# EAGLE design LED-Board_long (EAGLE 9.2.2)
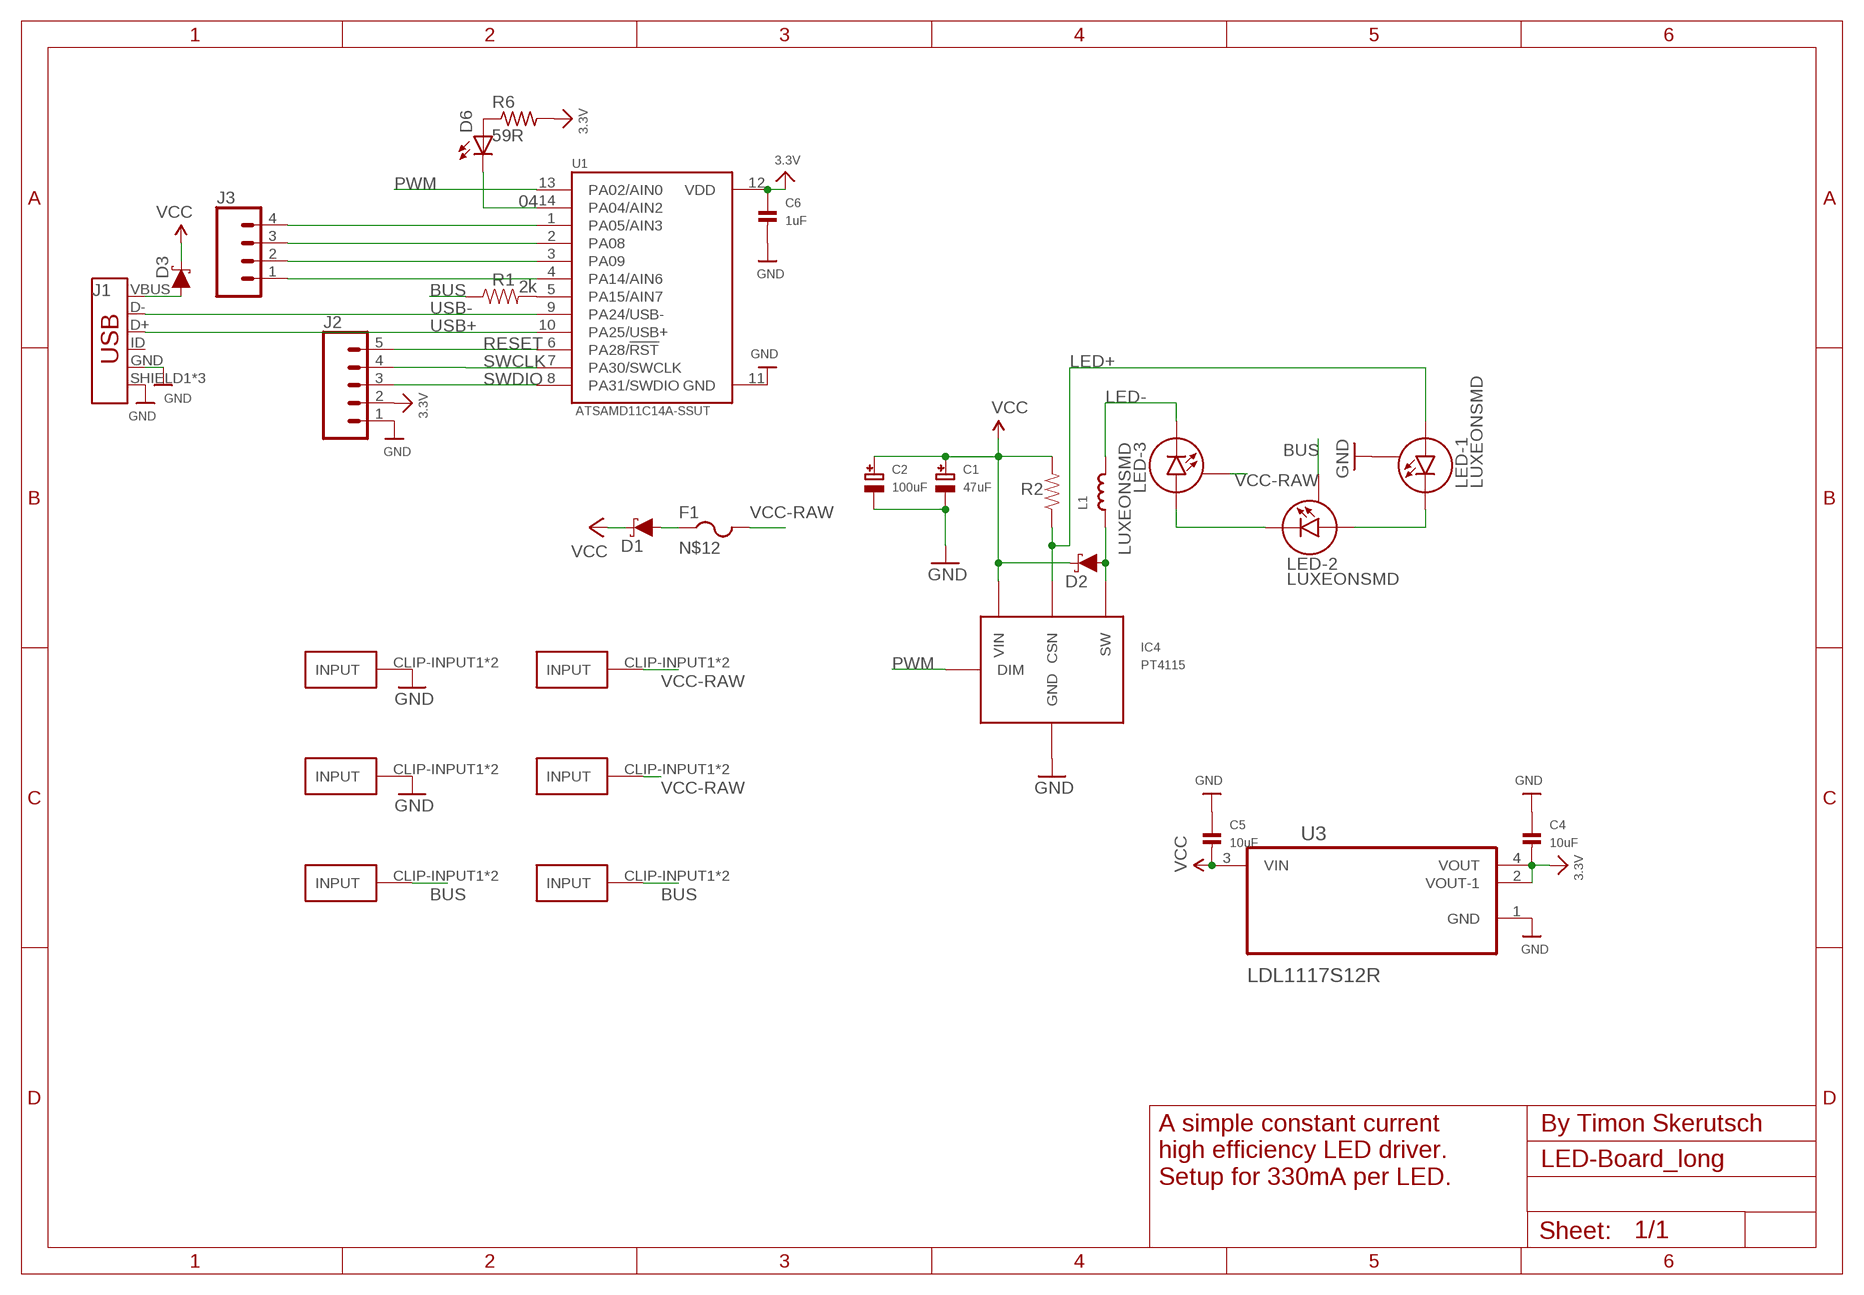
[diagram p0: schematic, sheet 1]

## Parts
C1  47uF  CAP_ELECTROLYTICPANASONIC_D  [PANASONIC_D]
C2  100uF  CAP_ELECTROLYTICPANASONIC_D  [PANASONIC_D]
C4  10uF  CAP_CERAMIC0805  [0805]
C5  10uF  CAP_CERAMIC0603  [0603]
C6  1uF  CAP_CERAMIC0603  [0603]
D1  3A/40V/500mV  DIODE-SCHOTTKY-B340A  [SMA-DIODE]
D2  3A/40V/500mV  DIODE-SCHOTTKY-B340A  [SMA-DIODE]
D3  3A/40V/500mV  DIODE-SCHOTTKY-B340A  [SMA-DIODE]
D6  LEDCHIPLED_0805  [CHIPLED_0805]
F1  TLC-MSMD110/24  PTCFUSE-1812  [1812]
GND-CLIP  FUSE-HOLDER-5X20MM  [FUSE-HOLDER-5X20MM]
GND-CLIP3  FUSE-HOLDER-5X20MM  [FUSE-HOLDER-5X20MM]
IC4  PT4115  [PT4115]
J1  USB_MICRO-B_FEMALE-SMT  [USB-B-MICRO-SMD]
J2  CONN_05  [1X05]
J3  CONN_04  [1X04]
L1  INDUCTORTDK_VLC6045  [INDUCTOR_6X6MM_TDK_VLC6045]
LED-1  LUXEONSMD  [LUXEON]
LED-2  LUXEONSMD  [LUXEON]
LED-3  LUXEONSMD  [LUXEON]
PWM-CLIP  FUSE-HOLDER-5X20MM  [FUSE-HOLDER-5X20MM]
PWM-CLIP1  FUSE-HOLDER-5X20MM  [FUSE-HOLDER-5X20MM]
R1  2k  RESISTOR1206  [1206]
R2  0.3  RESISTOR1206  [1206]
R6  59R  R-US_R0805  [R0805]
U1  ATSAMD11C14A-SSUT  [SOIC127P600X160-14N]
U3  LDL1117S12R  [SOT230P700X180-4N]
VCC-CLIP  FUSE-HOLDER-5X20MM  [FUSE-HOLDER-5X20MM]
VCC-CLIP3  FUSE-HOLDER-5X20MM  [FUSE-HOLDER-5X20MM]

## Nets
3.3V [VCC]: C4.2 C6.1 J2.2 R6.2 U1.12(VDD) U3.2(VOUT-1) U3.4(VOUT)
04: D6.C U1.14(PA04/AIN2)
BUS: LED-2.S PWM-CLIP1.CLIP-INPUT1(INPUT) PWM-CLIP1.CLIP-INPUT2(INPUT) PWM-CLIP.CLIP-INPUT1(INPUT) PWM-CLIP.CLIP-INPUT2(INPUT) R1.1
GND: C1.- C2.- C4.1 C5.1 C6.2 GND-CLIP3.CLIP-INPUT1(INPUT) GND-CLIP3.CLIP-INPUT2(INPUT) GND-CLIP.CLIP-INPUT1(INPUT) GND-CLIP.CLIP-INPUT2(INPUT) IC4.2(GND) IC4.2A(GND) J1.GND J1.SHIELD1(SHIELD) J1.SHIELD2(SHIELD) J1.SHIELD3(SHIELD) J2.1 LED-1.S U1.11(GND) U3.1(GND)
LED+: IC4.4(CSN) LED-1.A R2.1
LED-: L1.P$2 LED-3.C
N$1: D2.A IC4.1(SW) L1.P$1
N$2: LED-1.C LED-2.A
N$3: LED-2.C LED-3.A
N$4 [VCC]: D3.A J1.VBUS
N$5: R1.2 U1.5(PA15/AIN7)
N$6: D6.A R6.1
N$7: J3.1 U1.4(PA14/AIN6)
N$8: J3.2 U1.3(PA09)
N$9: J3.3 U1.2(PA08)
N$12 [VCC]: D1.A F1.1
N$13: J3.4 U1.1(PA05/AIN3)
PWM: IC4.3(DIM) U1.13(PA02/AIN0)
RESET: J2.5 U1.6(PA28/!RST)
SWCLK: J2.4 U1.7(PA30/SWCLK)
SWDIO: J2.3 U1.8(PA31/SWDIO)
USB+: J1.D+ U1.10(PA25/USB+)
USB-: J1.D- U1.9(PA24/USB-)
VCC [VCC]: C1.+ C2.+ C5.2 D1.C D2.C D3.C IC4.5(VIN) R2.2 U3.3(VIN)
VCC-RAW [VCC]: F1.2 LED-3.S VCC-CLIP3.CLIP-INPUT1(INPUT) VCC-CLIP3.CLIP-INPUT2(INPUT) VCC-CLIP.CLIP-INPUT1(INPUT) VCC-CLIP.CLIP-INPUT2(INPUT)
Unconnected: J1.ID

## Notes on the sheet
- By Timon Skerutsch
- A simple constant current
  high efficiency LED driver.
  Setup for 330mA per LED.

## Library data of the parts
C1 C2 = microbuilder:CAP_ELECTROLYTIC: Electrolytic Capacitors SMT PANASONIC_C - Size C Panasonic Electrolytic Aluminum Capacitor 47µF 16V 20% Electrolytic Capacitor [Digikey: PCE3890TR-ND] PANASONIC_D - Size D Panasonic Electrolytic Aluminum Capacitor 100µF 25V 20% Electrolytic Capacitor [Digikey: PCE3898TR-ND] PTH 3.5 mm grid, 8 mm diameter ... 3.5 mm grid, 10 mm diameter ...
C4-C6 = microbuilder:CAP_CERAMIC: Ceramic Capacitors 0402 - 0402 Surface Mount Capacitors 16pF 50V 5% [Digikey: 445-4899-2-ND] 18pF 50V 5% [Digikey: 490-1281-2-ND] 22pF 50V 5% [Digikey: 490-1283-2-ND] 68pF 50V 5% [Digikey: 490-1289-2-ND] 0.1uF 10V 10% [Digikey: 490-1318-2-ND] 1.0uF 6.3V 10% [Digikey: 490-1320-2-ND] 0603 - 0603 Surface Mount Capacitors 16 pF 50V 5% [Digikey: 445-5051-2-ND] 22 pF 50V [Digikey: PCC220ACVTR-ND] 33 pF 50V 5% [Digikey: 490-1415-1-ND] 56pF 50V 5% [Digikey: 490-1421-1-ND] 220pF 50V 5% [Digikey: 445-1285-1-ND] 680 pF 50V 2200 pF 50V 5% C0G [Digikey: 445-1297-1-ND] 5600 pF 100V 5% X7R [Digikey: 478-3711-1-ND] 0.1 µF 25V 10% [Digikey: PCC2277TR-ND] 0.22 µF 16V 10% X7R [Digikey: 445-1318-1-ND] 1.0 µF 25V 10% [Digikey: 445-5146-2-ND] 0603 - RF Specific 3pF 250V +/-0.1pF RF [Digikey: 712-1347-1-ND] 18 pF 250V 5% [Digikey: 478-3505-1-ND or 712-1322-1-ND] 56 pF 250V 5% C0G RF [Digikey: 490-4867-1-ND] 68 pF 250V RF [Digikey: 490-4868-1-ND] 0805 - 0805 Surface Mount Capacitors 220 pF 250V 2% RF Ceramic Capacitor [Digikey: 712-1398-1-ND] 1000 pF 50V 2% NP0 Ceramic Capacitor [Digikey: 478-3760-1-ND] 0.1 µF 25V 10% Ceramic Capacitor [Digikey: PCC1828TR-ND] 1.0 µF 16V 10% Ceramic Capacitor[Digikey: 490-1691-2-ND] 10.0 µF 10V 10% Ceramic Capacitor[Digikey: 709-1228-1-ND] 10.0 uF 16V 10% Ceramic Capacitor [Digikey: 478-5165-2-ND] 47 uF 6.3V 20% Ceramic Capacitor [Digikey: 587-1779-1-ND or 399-5506-1-ND] 1206 - 1206 Surface Mount Capacitors 47uF 10V 20% Ceramic Capacitor [Digikey: 490-5528-1-ND or 399-5508-1-ND or 445-6010-1-ND] 100uF 6.3V -20%, +80% Y5V Ceramic Capacitor (Digikey: 490-4512-1-ND, Mouser: 81-GRM31CF50J107ZE1L)
D1-D3 = SparkFun-DiscreteSemi:DIODE-SCHOTTKY: Schottky diode A Schottky diode is a semiconductor diode which has a low forward voltage drop and a very fast switching action.; PROD_ID: DIO-09886
D6 = Adafruit:LED: LED OSRAM: - CHIPLED LG R971, LG N971, LY N971, LG Q971, LY Q971, LO R971, LY R971 LH N974, LH R974 LS Q976, LO Q976, LY Q976 LO Q996 - Hyper CHIPLED LW Q18S LB Q993, LB Q99A, LB R99A - SideLED LS A670, LO A670, LY A670, LG A670, LP A670 LB A673, LV A673, LT A673, LW A673 LH A674 LY A675 LS A676, LA A676, LO A676, LY A676, LW A676 LS A679, LY A679, LG A679 - Hyper Micro SIDELED® LS Y876, LA Y876, LO Y876, LY Y876 LT Y87S - SmartLED LW L88C, LW L88S LB L89C, LB L89S, LG L890 LS L89K, LO L89K, LY L89K LS L896, LA L896, LO L896, LY L896 - TOPLED LS T670, LO T670, LY T670, LG T670, LP T670 LSG T670, LSP T670, LSY T670, LOP T670, LYG T670 LG T671, LOG T671, LSG T671 LB T673, LV T673, LT T673, LW T673 LH T674 LS T676, LA T676, LO T676, LY T676, LB T676, LH T676, LSB T676, LW T676 LB T67C, LV T67C, LT T67C, LS T67K, LO T67K, LY T67K, LW E67C LS E67B, LA E67B, LO E67B, LY E67B, LB E67C, LV E67C, LT E67C LW T67C LS T679, LY T679, LG T679 LS T770, LO T770, LY T770, LG T770, LP T770 LB T773, LV T773, LT T773, LW T773 LH T774 LS E675, LA E675, LY E675, LS T675 LS T776, LA T776, LO T776, LY T776, LB T776 LHGB T686 LT T68C, LB T68C - Hyper Mini TOPLED® LB M676 - Mini TOPLED Santana® LG M470 LS M47K, LO M47K, LY M47K Source: http://www.osram.convergy.de/
F1 = Adafruit:PTCFUSE: PTC fuses, resettable thermistors
GND-CLIP GND-CLIP3 PWM-CLIP PWM-CLIP1 VCC-CLIP VCC-CLIP3 = timon-diverses:FUSE-HOLDER-5X20MM
IC4 = PT4115:PT4115: 30V, 1.2A Step-down High Brightness LED Driver with 5000:1 Dimming PDF: http://www.google.pl/url?sa=t&rct=j&q=PT4115&source=web&cd=1&ved=0CC4QFjAA&url=http%3A%2F%2Fwww.micro-bridge.com%2Fdata%2FCRpowtech%2FPT4115E.pdf&ei=9NbxUKXPJNSzhAem2oGoAQ&usg=AFQjCNEsPWIIWjIVjxpF5YN6SPR3coTTpw&bvm=bv.1357700187,d.d2k
J1 = SparkFun-Connectors:USB_MICRO-B: USB Type Micro-B Connector Male/female and PTH/SMT variants SparkFun Products: SparkFun microB USB Breakout <https://www.sparkfun.com/products/12035> SparkFun USB microB Plug Breakout <https://www.sparkfun.com/products/10031> SparkFun ESP8266 Thing <https://www.sparkfun.com/products/13231>; PROD_ID: CONN-11752
J2 = SparkFun-Connectors:CONN_05: Multi connection point. Often used as Generic Header-pin footprint for 0.1 inch spaced/style header connections On any of the 0.1 inch spaced packages, you can populate with these: Break Away Headers - Straight <https://www.sparkfun.com/products/116> (PRT-00116) Break Away Male Headers - Right Angle <https://www.sparkfun.com/products/553> (PRT-00553) Female Headers <https://www.sparkfun.com/products/115> (PRT-00115) Break Away Headers - Machine Pin <https://www.sparkfun.com/products/117> (PRT-00117) Break Away Female Headers - Swiss Machine Pin <https://www.sparkfun.com/products/743> (PRT-00743) For SCREWTERMINALS and SPRING TERMINALS visit here: Screw Terimnals on SparkFun.com <https://www.sparkfun.com/search/results?term=Screw+Terminals> (5mm/3.5mm/2.54mm spacing) This device is also useful as a general connection point to wire up your design to another part of your project. Our various solder wires solder well into these plated through hole pads. Hook-Up Wire - Assortment (Stranded, 22 AWG) <https://www.sparkfun.com/products/11375> (PRT-11375) Hook-Up Wire - Assortment (Solid Core, 22 AWG) <https://www.sparkfun.com/products/11367> (PRT-11367) View the entire wire category on our website here <https://www.sparkfun.com/categories/141> Special notes: Molex polarized connector foot print use with SKU : PRT-08231 with associated crimp pins and housings. 1MM SMD Version SKU: PRT-10208
J3 = SparkFun-Connectors:CONN_04: Multi connection point. Often used as Generic Header-pin footprint for 0.1 inch spaced/style header connections On any of the 0.1 inch spaced packages, you can populate with these: Break Away Headers - Straight <https://www.sparkfun.com/products/116> (PRT-00116) Break Away Male Headers - Right Angle <https://www.sparkfun.com/products/553> (PRT-00553) Female Headers <https://www.sparkfun.com/products/115> (PRT-00115) Break Away Headers - Machine Pin <https://www.sparkfun.com/products/117> (PRT-00117) Break Away Female Headers - Swiss Machine Pin <https://www.sparkfun.com/products/743> (PRT-00743) For SCREWTERMINALS and SPRING TERMINALS visit here: Screw Terimnals on SparkFun.com <https://www.sparkfun.com/search/results?term=Screw+Terminals> (5mm/3.5mm/2.54mm spacing) This device is also useful as a general connection point to wire up your design to another part of your project. Our various solder wires solder well into these plated through hole pads. Hook-Up Wire - Assortment (Stranded, 22 AWG) <https://www.sparkfun.com/products/11375> (PRT-11375) Hook-Up Wire - Assortment (Solid Core, 22 AWG) <https://www.sparkfun.com/products/11367> (PRT-11367) View the entire wire category on our website here <https://www.sparkfun.com/categories/141> Special notes: Molex polarized connector foot print use with SKU : PRT-08231 with associated crimp pins and housings. 1MM SMD Version SKU: PRT-10208; PROD_ID: CONN-09696
L1 = microbuilder:INDUCTOR: Inductors 0603: 10nH Ceramic Inductor - microwire antenna/RF (Digikey: 712-1434-2-ND) 0805: 560nH Ceramic Inductor - RF (Digikey: 553-1047-1-ND) 270nH Ceramic Inductor - Q = 40@250MHz, +-5%, 1 Ohm DC Resistance (Digikey: 535-10506-2-ND) 1007 (2518 Metric) SMT: 10µH 10% 250mOhm 820mA 1007 Inductor (Digikey: 587-2189-1-ND) 22µH 10% 500mOhm 580mA 1007 Inductor (Digikey: 587-2190-1-ND) 47µH 10% 950mOhm 420mA 1007 Inductor (Digikey: 587-2191-1-ND) 47µH 5% 100mOhm 1A 1008 Inductor (Digikey: 732-1816-1-ND) 5.0x5.0mm (Taiyo Yuden NR5040 Series) 6.8µH 20% 2.3A 64mOhm Inductor (Digikey: 587-2374-2-ND) 5.0x5.0mm (TDK VLC5045 Series) 4.7µH 20% 3.3A 34mOhm Inductor (Digikey: 445-6526-1-ND) 6.8µH 20% 2.7A 46mOhm Inductor (Digikey: 445-6527-1-ND) 6.0x6.0mm (TDK VLC6045 Series) 4.7µH 20% 3.8A 27mOhm Inductor (Digikey: 445-6538-2-ND) 6.8µH 20% 3A 41mOhm Inductor (Digikey: 445-6540-1-ND) 6.2µH 30% 2.2A 45mOhm Inductor (Digikey: SRR5028-6R2YCT-ND) - Not TDK VLC6045 but footprint should match 6.0x6.0mm (TDK SLF6045 Series) 6.8uH 30% 2A 33mOhm Inductor (Digikey: 445-4572-1-ND, Mouser: 810-SLF645T6R8N2R0PF)
LED-1-LED-3 = SparkFun-LED:LUXEON: Luxeon LED This footprint works with the current 1 Watt, 3 Watt, and 5 Watt LEDs. These blindingly bright LEDs generate a lot of heat so the footprint has a large pad under the LED for thermal transfer. Schematic and footprint are proven. Spark Fun Electronics SKU : COM-00603
R1 R2 = SparkFun-Resistors:RESISTOR: Resistor Basic schematic elements and footprints for 0603, 1206, and PTH resistors.
R6 = Adafruit:R-US_: RESISTOR, American symbol
U1 = ATSAMD11C14A-SSUT:ATSAMD11C14A-SSUT: MCU 32-Bit SAM D11 ARM Cortex M0+ RISC 16KB Flash 1.8V/2.5V/3.3V 14-Pin SOIC T/R; AVAILABILITY: Good; DESCRIPTION: Cortex-M0+, 16KB FLASH, 4KB SRAM, USB - 14 SOIC, INDUSTRIAL, GREEN, 1.6-3.6V, 48MHz/ SOIC .150 (SS); MF: Microchip; MP: ATSAMD11C14A-SSUT; PACKAGE: SOIC-14 Microchip; PRICE: 1.18 USD
U3 = LDL1117S12R:LDL1117S12R: None; AVAILABILITY: Good; DESCRIPTION: 1.2 A High PSRR low dropout linear voltage regulator; MF: STMicroelectronics; MP: LDL1117S12R; PACKAGE: SOT-223 STMicroelectronics; PRICE: 0.22 USD

## Net classes
1 VCC: clearance 0.254 mm

## Board
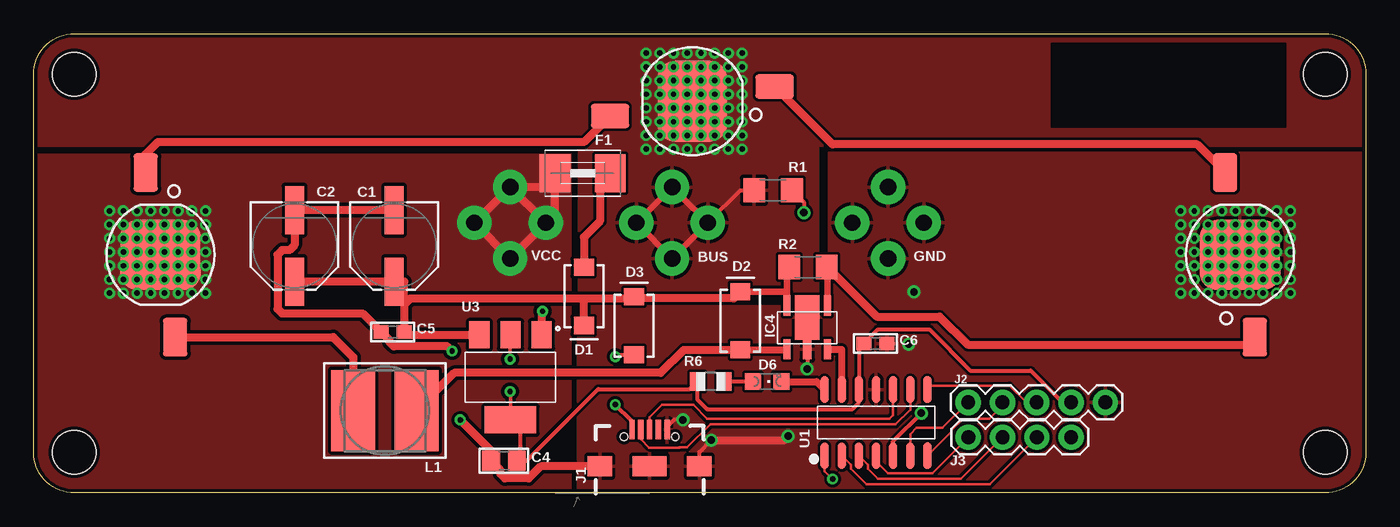
[diagram p1: board, top side]
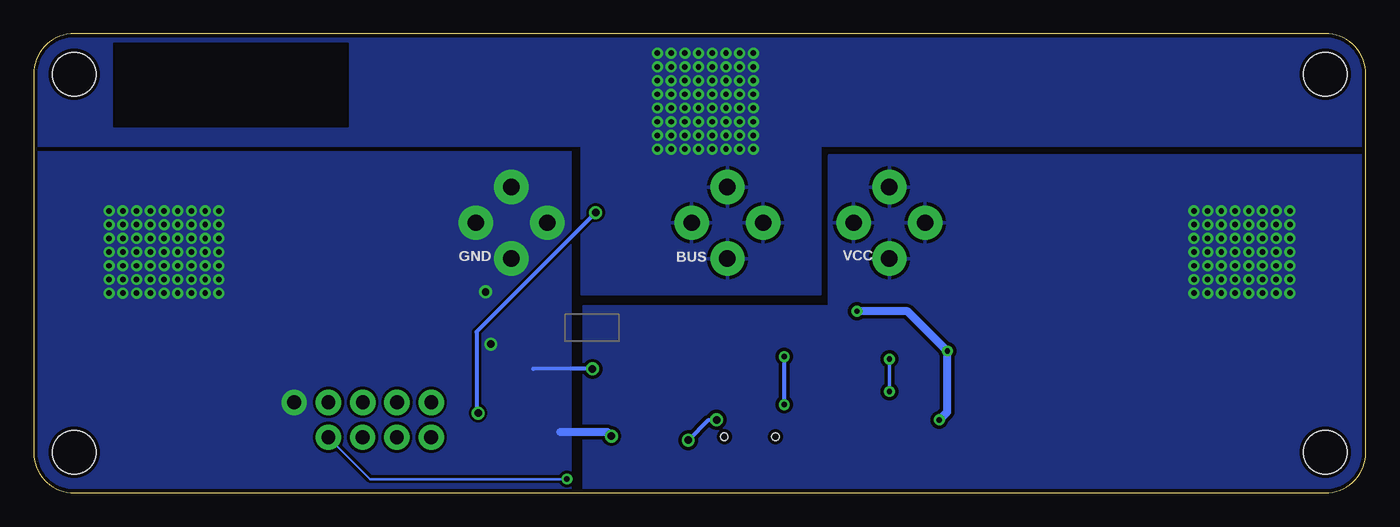
[diagram p2: board, bottom side, seen from below]

Size 98.7 x 34 mm. Coordinates in mm from the lower left corner, seen from the top.
Outline: 0,3 0,31 arc-90 3,34 95.7,34 arc-90 98.7,31 98.7,3 arc-90 95.7,0 3,0 arc-90 0,3
Copper layers (1*16): Top 0.035mm / dielectric 1.5mm / Bottom 0.035mm
Design rules "adafruit-modified-for-pcb-ng *": minimum track width 8mil, minimum drill 15.5mil, track to track 8mil, track to pad 8mil, pad to pad 8mil, via to via 8mil, smd to smd 0mil, copper to edge 11mil, drill to drill 8mil, minimum pad ring 10mil, minimum via ring 8mil, stop-mask expansion 0.116840625mm, vias tented up to drill 20mil, thermal gap 10mil
Holes 3.2 mm at 3,3 3,31 95.7,31 95.7,3
tRestrict: area 75.4,27.1 to 92.8,33.3
bRestrict: area 75.4,27.1 to 92.8,33.3

### Footprints (pad centres in the part's own frame; a part is rotated, then mirrored left to right if it is on the bottom)
PANASONIC_D = smd 3.556 x 1.4: + 2.654,0; - -2.654,0
0805 = smd 1.3 x 1.5: 1 -0.95,0; 2 0.95,0
0603 = smd 1.1 x 1: 1 -0.85,0; 2 0.85,0
SMA-DIODE = smd 1.27 x 1.47: A -2.15,0; C 2.15,0
CHIPLED_0805 = smd 1.2 x 1.2: A 0,-1.05; C 0,1.05
1812 = smd 2.286 x 2.794: 1 -2.046,0; 2 2.046,0
FUSE-HOLDER-5X20MM = drill 1.22 pad 2.54: CLIP-INPUT1 -2.65,0; CLIP-INPUT2 2.65,0
PT4115 = smd 0.5 x 1.5: 1 0,0; 3 3,0; 4 3,3.25; 5 0,3.25 | smd 0.65 x 1.5: 2 1.5,0 | smd 1.8 x 3.3: 2A 1.5,2.375
USB-B-MICRO-SMD = smd 1.45 x 0.4: D+ 2.725,0; D- 2.725,0.65; GND 2.725,-1.3; ID 2.725,-0.65; VBUS 2.725,1.3 | smd 1.5 x 1.8: SHIELD1 0,3.685; SHIELD2 0,-3.685 | smd 1.5 x 2.5: SHIELD3 0,0 | hole 0.55: 2.2,1.9; 2.2,-1.9
1X05 = drill 1.016 pad 1.88: 1 0,0; 2 2.54,0; 3 5.08,0; 4 7.62,0; 5 10.16,0
1X04 = drill 1.016 pad 1.88: 1 0,0; 2 2.54,0; 3 5.08,0; 4 7.62,0
INDUCTOR_6X6MM_TDK_VLC6045 = smd 3.25 x 6: P$1 -2.35,0; P$2 2.35,0
LUXEON = smd 2.85 x 1.8: A -6.1,-1.1; C 6.1,1.1 | smd 5.2 x 6: S 0,0
1206 = smd 1.6 x 1.8: 1 -1.4,0; 2 1.4,0
R0805 = smd 1.1 x 1.4: 1 -1,0; 2 1,0
SOIC127P600X160-14N = smd 2 x 0.6: 1 -2.45,3.81; 2 -2.45,2.54; 3 -2.45,1.27; 4 -2.45,0; 5 -2.45,-1.27; 6 -2.45,-2.54; 7 -2.45,-3.81; 8 2.45,-3.81; 9 2.45,-2.54; 10 2.45,-1.27; 11 2.45,0; 12 2.45,1.27; 13 2.45,2.54; 14 2.45,3.81
SOT230P700X180-4N = smd 1.5 x 2: 1 -2.3,-3.15; 2 0,-3.15; 3 2.3,-3.15 | smd 3.8 x 2: 4 0,3.15

### Placement (x,y rotation side)
C1  26.71,18.29 270 top
C2  19.32,18.29 270 top
C4  34.84,2.38 0 top
C5  26.6,11.91 0 top
C6  62.37,11.05 0 top
D1  40.77,14.54 270 top
D2  52.35,12.74 90 top
D3  44.49,12.37 90 top
D6  54.35,8.24 270 top
F1  40.68,23.67 180 top
GND-CLIP  63.3,20 0 bottom
GND-CLIP3  63.3,20 90 bottom
IC4  55.82,10.62 0 top
J1  45.63,1.96 90 top
J2  79.4,6.7 180 top
J3  69.25,4.12 0 top
L1  26.02,6.08 180 top
LED-1  89.38,17.62 90 top
LED-2  48.8,29 180 top
LED-3  9.39,17.62 270 top
PWM-CLIP  47.3,20 0 bottom
PWM-CLIP1  47.3,20 90 bottom
R1  54.78,22.4 0 top
R2  57.37,16.71 180 top
R6  50.16,8.24 180 top
U1  62.41,5.2 90 top
U3  35.32,8.55 180 top
VCC-CLIP  35.3,20 0 bottom
VCC-CLIP3  35.3,19.99 270 bottom

### Tracks (layer width: path | path; a pad name or v marks a point on that pad's centre or on a via)
3.3V  (via drill 0.39)
  Top 0.254: U3.4 35.32,7.48 v35.3,7.5 | v35.3,9.9 35.3,11.68 U3.2
  Top 0.305: 35.6,5.13 36.04,4.69 36.04,2.63 C4.2 36.52,2.38 41.82,7.67 48.59,7.67 R6.2 49.16,6.93 49.9,6.2 60.67,6.2 61.14,6.67 U1.12 61.14,10.68 C6.1 | C6.1 61.52,11.37 | J2.2 76.22,6.7 73.87,9.05 69.4,9.05 66.35,12.1 62.56,12.1 C6.1
  Top 0.508: U3.4 35.6,5.13 35.79,4.94
  Bottom 0.254: v35.3,7.5 v35.3,9.9
04
  Top 0.508: D6.C 58.01,8.24 U1.14
BUS  (via drill 0.4)
  Top 0.305: PWM-CLIP.CLIP-INPUT1 50.01,20.06 52.35,22.4 R1.1
  Top 0.483: PWM-CLIP1.CLIP-INPUT2 | 50.01,20.06 50.01,20.05 PWM-CLIP1.CLIP-INPUT1 PWM-CLIP.CLIP-INPUT2 PWM-CLIP1.CLIP-INPUT2 | PWM-CLIP.CLIP-INPUT1 47.94,22.01 PWM-CLIP1.CLIP-INPUT2
  other vias: 45.38,27.48 45.38,26.47 45.38,25.45 46.39,25.45 47.41,25.45 48.42,25.45 49.44,25.45 49.44,26.47 48.42,26.47 47.41,26.47 46.39,26.47 46.39,27.48 47.41,27.48 48.42,27.48 49.44,27.48 50.46,25.45 50.46,26.47 50.46,27.48 51.47,27.48 51.47,26.47 51.47,25.45 52.49,25.45 52.49,26.47 52.49,27.48 52.49,28.5 51.47,28.5 50.46,28.5 49.44,28.5 48.42,28.5 47.41,28.5 46.39,28.5 45.38,28.5 45.38,29.52 46.39,29.52 47.41,29.52 48.42,29.52 49.44,29.52 50.46,29.52 51.47,29.52 52.49,29.52 52.49,30.53 51.47,30.53 50.46,30.53 49.44,30.53 48.42,30.53 47.41,30.53 46.39,30.53 45.38,30.53 45.38,31.55 46.39,31.55 47.41,31.55 48.42,31.55 49.44,31.55 50.46,31.55 51.47,31.55 52.49,31.55 52.49,32.56 51.47,32.56 50.46,32.56 49.44,32.56 48.42,32.56 47.41,32.56 46.39,32.56 45.38,32.56
  pour Top (no thermals): 44.74,33.71 53,33.71 53,24.69 44.74,24.69
  pour Top: -1,35.3 -1,25.7 40.4,25.7 40.4,14.7 58.1,14.7 58.1,25.7 100.9,25.7 100.9,35.3
  pour Bottom: 99.2,35.3 99.2,25.7 58.1,25.7 58.1,14.7 40.4,14.7 40.4,25.7 -2.5,25.7 -2.5,35.3
GND  (via drill 0.39, 0.4, 0.55)
  Top 0.203: J1.GND 46.93,4.9 46.93,5.16 47.03,5.26
  Top 0.305: IC4.2 57.31,9.19 v57.3,9.18 | J1.SHIELD2 49.31,3.02 v50.2,3.9 | v48.1,5.4 47.43,5.4 46.93,4.9
  Top 0.61: C1.- C2.- 19.32,18.33 18.96,17.97 18.39,17.97 18.06,17.64 18.06,13.62 18.39,13.29 24.36,13.29 C5.1 26.34,11.32 26.34,11.18 26.68,10.84 30.66,10.84 v31,10.5 | J1.SHIELD1 37.56,1.96 36.67,1.07 34.91,1.07 34.58,1.39 34.58,1.68 C4.1 33.89,3.11 v31.6,5.4 | v37.7,13.44 37.62,13.37 U3.1 | v50.2,3.9 55.6,3.9 v55.9,4.2
  Bottom 0.305: v57.3,9.18 61.68,9.18 61.7,9.2 | v50.2,3.9 48.7,5.4 v48.1,5.4
  Bottom 0.61: v31.6,5.4 31,6 v31,10.5 33.94,13.44 v37.7,13.44 | v55.9,4.2 56.2,4.5 59.7,4.5
  other vias: 64.83,11.01 65.22,14.88 91.08,20.88 92.1,20.88 90.06,20.88 89.05,20.88 88.03,20.88 87.02,20.88 86,20.88 92.1,19.86 93.11,20.88 84.98,20.88 84.98,19.86 86,19.86 87.02,19.86 88.03,19.86 89.05,19.86 90.06,19.86 91.08,19.86 84.98,18.85 86,18.85 87.02,18.85 88.03,18.85 89.05,18.85 90.06,18.85 91.08,18.85 92.1,18.85 93.11,19.86 93.11,18.85 84.98,17.83 86,17.83 87.02,17.83 88.03,17.83 89.05,17.83 90.06,17.83 91.08,17.83 92.1,17.83 93.11,17.83 84.98,16.82 86,16.82 87.02,16.82 88.03,16.82 89.05,16.82 90.06,16.82 91.08,16.82 92.1,16.82 93.11,16.82 84.98,15.8 86,15.8 87.02,15.8 88.03,15.8 89.05,15.8 90.06,15.8 91.08,15.8 92.1,15.8 93.11,15.8 84.98,14.78 86,14.78 87.02,14.78 88.03,14.78 89.05,14.78 90.06,14.78 91.08,14.78 92.1,14.78 93.11,14.78
  pour Top: 40.3,-1.8 100.9,-1.8 100.9,25.2 58.9,25.2 58.9,13.8 40.3,13.8
  pour Bottom (no thermals): 99.23,25.24 99.23,-2.11 58.88,-2.11 58.88,25.24
LED+
  Top 0.483: IC4.4 58.81,16.71 R2.1
  Top 0.61: 58.81,16.71 62.48,13.05 67.12,13.05 69.2,10.97 90.44,10.97 90.48,10.94 LED-1.A
LED-
  Top 0.61: LED-3.C 22.19,11.52 23.67,10.05 L1.P$2
N$1
  Top 0.508: D2.A 55.81,10.59 IC4.1
  Top 0.61: L1.P$1 31.16,8.87 46.45,8.87 48.17,10.59 48.18,10.59 D2.A
N$2
  Top 0.61: LED-2.A 59.2,25.8 86.2,25.8 LED-1.C
N$3
  Top 0.61: LED-3.A 8.29,25.07 9.19,25.98 40.77,25.98 LED-2.C
N$4  (via drill 0.4)
  Top 0.305: J1.VBUS 44.33,5.29 v43.09,6.53 | v43.09,10.09 43.23,10.22 D3.A
  Bottom 0.305: v43.09,6.53 v43.09,10.09
N$5  (via drill 0.55)
  Top 0.305: R1.2 57.06,21.52 v57.06,20.75 | v65.77,5.89 63.68,3.8 U1.5
  Bottom 0.305: v57.06,20.75 65.9,11.91 65.9,6.02 v65.77,5.89
N$6
  Top 0.305: D6.A R6.1
N$7
  Top 0.203: U1.4 62.41,2.32 63.29,1.44 66.58,1.44 J3.1
N$8
  Top 0.203: U1.3 61.8,2.08 61.8,1.79 62.57,1.03 68.71,1.03 J3.2
N$9
  Top 0.203: U1.2 60.53,2.08 60.53,1.79 61.7,0.63 70.84,0.63 J3.3
N$12
  Top 0.61: F1.1 41.95,22.9 41.95,20.12 40.77,18.94 D1.A
N$13  (via drill 0.4)
  Top 0.203: U1.1 58.6,1.61 v59.19,1.02
  Bottom 0.203: v59.19,1.02 73.77,1.02 J3.4
PWM
  Top 0.508: IC4.3 59.85,10.62 59.85,7.66 U1.13
RESET
  Top 0.203: U1.6 64.95,4.35 65.4,4.8 67.34,4.8 J2.5
SWCLK
  Top 0.203: U1.7 68.01,4.53 68.01,4.63 68.83,5.46 69.76,5.46 69.8,5.5 70.8,5.5 71.78,6.48 J2.4
  Top 0.305: U1.7 66.22,3.62
SWDIO
  Top 0.203: J2.3 73.54,6.7 72.3,7.95 66.52,7.95 U1.8
USB+
  Top 0.203: U1.10 63.68,5.76 63.4,5.48 49.9,5.48 48.87,6.5 46.54,6.5 45.63,5.59 J1.D+
USB-
  Top 0.203: J1.D- 45,4.66 45,3.96 45.6,3.35 47.86,3.35 47.87,3.35 48.42,3.35 50.14,5.07 63.86,5.07 64.95,6.16 U1.9
VCC
  Top 0.483: R2.2 55.81,16.71 IC4.5 55.81,14.89 D2.C
  Top 0.61: 52.06,14.59 D2.C 51.87,14.4 44.49,14.4 | 40.77,14.4 27.92,14.4 27.45,13.93 | 27.45,13.93 C5.2 27.65,11.7 U3.3 | 40.77,14.4 44.49,14.4 | 44.49,14.4 D3.C | D1.C 40.77,14.4 | 27.45,13.93 27.45,15.63 C1.+ C2.+
VCC-RAW  (via drill 0.4)
  Top 0.483: VCC-CLIP3.CLIP-INPUT2 35.3,17.35 | VCC-CLIP.CLIP-INPUT1 37.84,19.89 37.84,20.11 | VCC-CLIP.CLIP-INPUT2
  Top 0.61: VCC-CLIP3.CLIP-INPUT2 37.84,19.89 | VCC-CLIP3.CLIP-INPUT1 37.84,20.11 | VCC-CLIP3.CLIP-INPUT1 VCC-CLIP.CLIP-INPUT2 | VCC-CLIP.CLIP-INPUT2 35.3,17.35 | VCC-CLIP.CLIP-INPUT1 38.63,20.68 F1.2 37.6,22.64 VCC-CLIP3.CLIP-INPUT1
  other vias: 6.64,19.86 7.65,19.86 8.67,19.86 9.68,19.86 10.7,19.86 11.72,19.86 12.73,19.86 12.73,18.85 11.72,18.85 10.7,18.85 9.68,18.85 8.67,18.85 7.65,18.85 6.64,18.85 6.64,17.83 7.65,17.83 8.67,17.83 9.68,17.83 10.7,17.83 11.72,17.83 12.73,17.83 5.62,17.83 5.62,18.85 5.62,19.86 5.62,16.82 6.64,16.82 7.65,16.82 8.67,16.82 9.68,16.82 10.7,16.82 11.72,16.82 12.73,16.82 12.73,15.8 11.72,15.8 10.7,15.8 9.68,15.8 8.67,15.8 7.65,15.8 6.64,15.8 5.62,15.8 5.62,14.78 6.64,14.78 7.65,14.78 8.67,14.78 9.68,14.78 10.7,14.78 11.72,14.78 12.73,14.78 5.62,20.88 6.64,20.88 7.65,20.88 8.67,20.88 9.68,20.88 10.7,20.88 11.72,20.88 12.73,20.88
  pour Top (no thermals): 5.1,21.39 13.35,21.39 13.35,14.02 5.1,14.02
  pour Top (no thermals): -1.03,25.04 -1.03,-1.91 39.82,-1.91 39.82,25.04
  pour Bottom: 58,-2.1 -2.6,-2.1 -2.6,25 39.8,25 39.8,13.8 58,13.8

### Text on the board
tNames: VCC | BUS | GND
bNames: VCC | BUS | GND